# EAGLE schematic Alphabet_Boards (EAGLE 6.5.0)
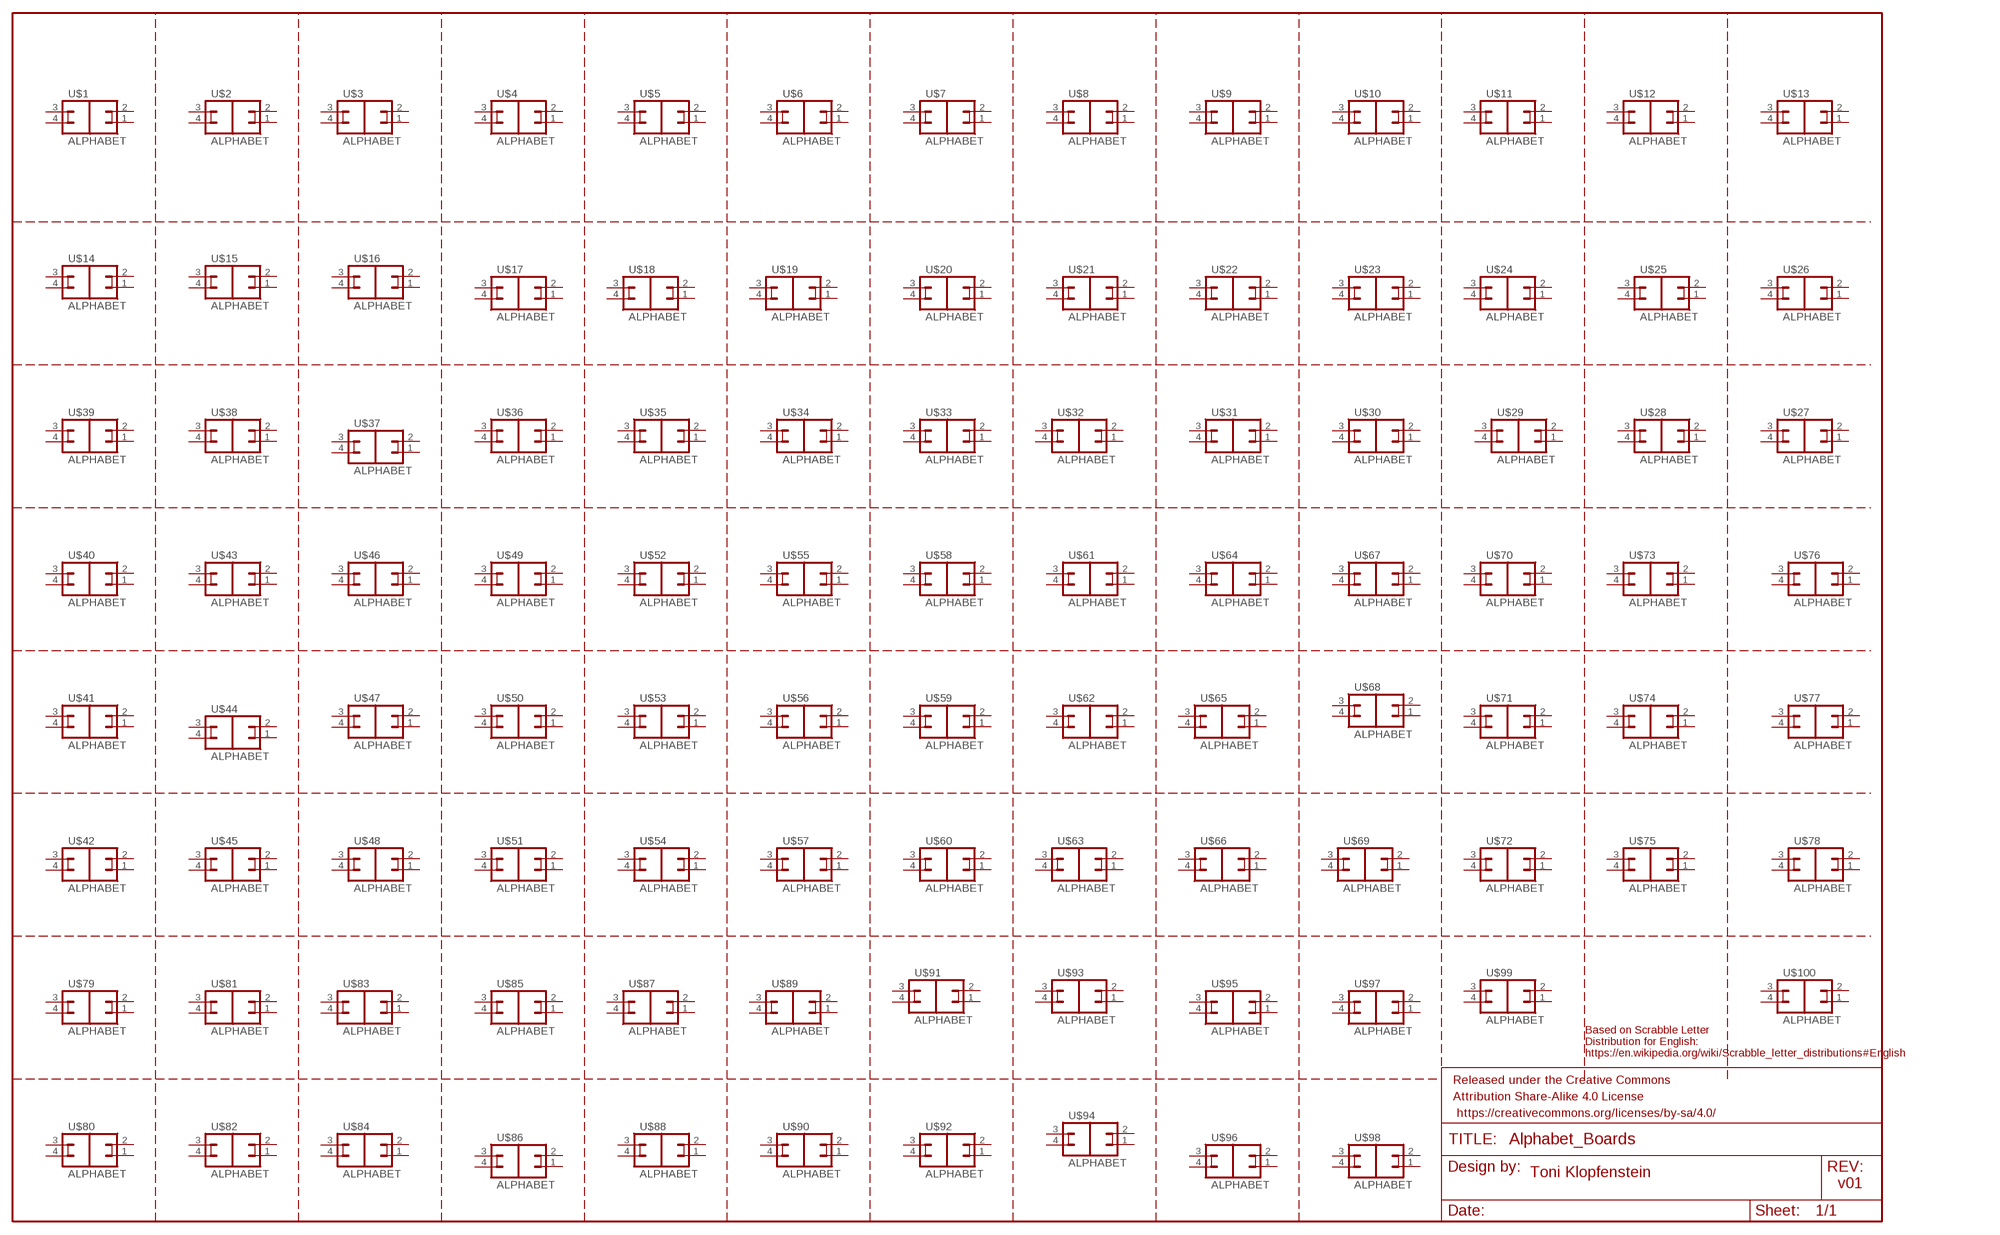
[diagram p0: schematic, sheet 1]

## Parts
FRAME1  FRAME-LEDGER  [CREATIVE_COMMONS]
U$1  ALPHABET  [ALPHABET_BOARD]
U$2  ALPHABET  [ALPHABET_BOARD]
U$3  ALPHABET  [ALPHABET_BOARD]
U$4  ALPHABET  [ALPHABET_BOARD]
U$5  ALPHABET  [ALPHABET_BOARD]
U$6  ALPHABET  [ALPHABET_BOARD]
U$7  ALPHABET  [ALPHABET_BOARD]
U$8  ALPHABET  [ALPHABET_BOARD]
U$9  ALPHABET  [ALPHABET_BOARD]
U$10  ALPHABET  [ALPHABET_BOARD]
U$11  ALPHABET  [ALPHABET_BOARD]
U$12  ALPHABET  [ALPHABET_BOARD]
U$13  ALPHABET  [ALPHABET_BOARD]
U$14  ALPHABET  [ALPHABET_BOARD]
U$15  ALPHABET  [ALPHABET_BOARD]
U$16  ALPHABET  [ALPHABET_BOARD]
U$17  ALPHABET  [ALPHABET_BOARD]
U$18  ALPHABET  [ALPHABET_BOARD]
U$19  ALPHABET  [ALPHABET_BOARD]
U$20  ALPHABET  [ALPHABET_BOARD]
U$21  ALPHABET  [ALPHABET_BOARD]
U$22  ALPHABET  [ALPHABET_BOARD]
U$23  ALPHABET  [ALPHABET_BOARD]
U$24  ALPHABET  [ALPHABET_BOARD]
U$25  ALPHABET  [ALPHABET_BOARD]
U$26  ALPHABET  [ALPHABET_BOARD]
U$27  ALPHABET  [ALPHABET_BOARD]
U$28  ALPHABET  [ALPHABET_BOARD]
U$29  ALPHABET  [ALPHABET_BOARD]
U$30  ALPHABET  [ALPHABET_BOARD]
U$31  ALPHABET  [ALPHABET_BOARD]
U$32  ALPHABET  [ALPHABET_BOARD]
U$33  ALPHABET  [ALPHABET_BOARD]
U$34  ALPHABET  [ALPHABET_BOARD]
U$35  ALPHABET  [ALPHABET_BOARD]
U$36  ALPHABET  [ALPHABET_BOARD]
U$37  ALPHABET  [ALPHABET_BOARD]
U$38  ALPHABET  [ALPHABET_BOARD]
U$39  ALPHABET  [ALPHABET_BOARD]
U$40  ALPHABET  [ALPHABET_BOARD]
U$41  ALPHABET  [ALPHABET_BOARD]
U$42  ALPHABET  [ALPHABET_BOARD]
U$43  ALPHABET  [ALPHABET_BOARD]
U$44  ALPHABET  [ALPHABET_BOARD]
U$45  ALPHABET  [ALPHABET_BOARD]
U$46  ALPHABET  [ALPHABET_BOARD]
U$47  ALPHABET  [ALPHABET_BOARD]
U$48  ALPHABET  [ALPHABET_BOARD]
U$49  ALPHABET  [ALPHABET_BOARD]
U$50  ALPHABET  [ALPHABET_BOARD]
U$51  ALPHABET  [ALPHABET_BOARD]
U$52  ALPHABET  [ALPHABET_BOARD]
U$53  ALPHABET  [ALPHABET_BOARD]
U$54  ALPHABET  [ALPHABET_BOARD]
U$55  ALPHABET  [ALPHABET_BOARD]
U$56  ALPHABET  [ALPHABET_BOARD]
U$57  ALPHABET  [ALPHABET_BOARD]
U$58  ALPHABET  [ALPHABET_BOARD]
U$59  ALPHABET  [ALPHABET_BOARD]
U$60  ALPHABET  [ALPHABET_BOARD]
U$61  ALPHABET  [ALPHABET_BOARD]
U$62  ALPHABET  [ALPHABET_BOARD]
U$63  ALPHABET  [ALPHABET_BOARD]
U$64  ALPHABET  [ALPHABET_BOARD]
U$65  ALPHABET  [ALPHABET_BOARD]
U$66  ALPHABET  [ALPHABET_BOARD]
U$67  ALPHABET  [ALPHABET_BOARD]
U$68  ALPHABET  [ALPHABET_BOARD]
U$69  ALPHABET  [ALPHABET_BOARD]
U$70  ALPHABET  [ALPHABET_BOARD]
U$71  ALPHABET  [ALPHABET_BOARD]
U$72  ALPHABET  [ALPHABET_BOARD]
U$73  ALPHABET  [ALPHABET_BOARD]
U$74  ALPHABET  [ALPHABET_BOARD]
U$75  ALPHABET  [ALPHABET_BOARD]
U$76  ALPHABET  [ALPHABET_BOARD]
U$77  ALPHABET  [ALPHABET_BOARD]
U$78  ALPHABET  [ALPHABET_BOARD]
U$79  ALPHABET  [ALPHABET_BOARD]
U$80  ALPHABET  [ALPHABET_BOARD]
U$81  ALPHABET  [ALPHABET_BOARD]
U$82  ALPHABET  [ALPHABET_BOARD]
U$83  ALPHABET  [ALPHABET_BOARD]
U$84  ALPHABET  [ALPHABET_BOARD]
U$85  ALPHABET  [ALPHABET_BOARD]
U$86  ALPHABET  [ALPHABET_BOARD]
U$87  ALPHABET  [ALPHABET_BOARD]
U$88  ALPHABET  [ALPHABET_BOARD]
U$89  ALPHABET  [ALPHABET_BOARD]
U$90  ALPHABET  [ALPHABET_BOARD]
U$91  ALPHABET  [ALPHABET_BOARD]
U$92  ALPHABET  [ALPHABET_BOARD]
U$93  ALPHABET  [ALPHABET_BOARD]
U$94  ALPHABET  [ALPHABET_BOARD]
U$95  ALPHABET  [ALPHABET_BOARD]
U$96  ALPHABET  [ALPHABET_BOARD]
U$97  ALPHABET  [ALPHABET_BOARD]
U$98  ALPHABET  [ALPHABET_BOARD]
U$99  ALPHABET  [ALPHABET_BOARD]
U$100  ALPHABET  [ALPHABET_BOARD]
Unconnected: U$1.1 U$1.2 U$1.3 U$1.4 U$2.1 U$2.2 U$2.3 U$2.4 U$3.1 U$3.2 U$3.3 U$3.4 U$4.1 U$4.2 U$4.3 U$4.4 U$5.1 U$5.2 U$5.3 U$5.4 U$6.1 U$6.2 U$6.3 U$6.4 U$7.1 U$7.2 U$7.3 U$7.4 U$8.1 U$8.2 U$8.3 U$8.4 U$9.1 U$9.2 U$9.3 U$9.4 U$10.1 U$10.2 U$10.3 U$10.4 U$11.1 U$11.2 U$11.3 U$11.4 U$12.1 U$12.2 U$12.3 U$12.4 U$13.1 U$13.2 U$13.3 U$13.4 U$14.1 U$14.2 U$14.3 U$14.4 U$15.1 U$15.2 U$15.3 U$15.4 U$16.1 U$16.2 U$16.3 U$16.4 U$17.1 U$17.2 U$17.3 U$17.4 U$18.1 U$18.2 U$18.3 U$18.4 U$19.1 U$19.2 U$19.3 U$19.4 U$20.1 U$20.2 U$20.3 U$20.4 U$21.1 U$21.2 U$21.3 U$21.4 U$22.1 U$22.2 U$22.3 U$22.4 U$23.1 U$23.2 U$23.3 U$23.4 U$24.1 U$24.2 U$24.3 U$24.4 U$25.1 U$25.2 U$25.3 U$25.4 U$26.1 U$26.2 U$26.3 U$26.4 U$27.1 U$27.2 U$27.3 U$27.4 U$28.1 U$28.2 U$28.3 U$28.4 U$29.1 U$29.2 U$29.3 U$29.4 U$30.1 U$30.2 U$30.3 U$30.4 U$31.1 U$31.2 U$31.3 U$31.4 U$32.1 U$32.2 U$32.3 U$32.4 U$33.1 U$33.2 U$33.3 U$33.4 U$34.1 U$34.2 U$34.3 U$34.4 U$35.1 U$35.2 U$35.3 U$35.4 U$36.1 U$36.2 U$36.3 U$36.4 U$37.1 U$37.2 U$37.3 U$37.4 U$38.1 U$38.2 U$38.3 U$38.4 U$39.1 U$39.2 U$39.3 U$39.4 U$40.1 U$40.2 U$40.3 U$40.4 U$41.1 U$41.2 U$41.3 U$41.4 U$42.1 U$42.2 U$42.3 U$42.4 U$43.1 U$43.2 U$43.3 U$43.4 U$44.1 U$44.2 U$44.3 U$44.4 U$45.1 U$45.2 U$45.3 U$45.4 U$46.1 U$46.2 U$46.3 U$46.4 U$47.1 U$47.2 U$47.3 U$47.4 U$48.1 U$48.2 U$48.3 U$48.4 U$49.1 U$49.2 U$49.3 U$49.4 U$50.1 U$50.2 U$50.3 U$50.4 U$51.1 U$51.2 U$51.3 U$51.4 U$52.1 U$52.2 U$52.3 U$52.4 U$53.1 U$53.2 U$53.3 U$53.4 U$54.1 U$54.2 U$54.3 U$54.4 U$55.1 U$55.2 U$55.3 U$55.4 U$56.1 U$56.2 U$56.3 U$56.4 U$57.1 U$57.2 U$57.3 U$57.4 U$58.1 U$58.2 U$58.3 U$58.4 U$59.1 U$59.2 U$59.3 U$59.4 U$60.1 U$60.2 U$60.3 U$60.4 U$61.1 U$61.2 U$61.3 U$61.4 U$62.1 U$62.2 U$62.3 U$62.4 U$63.1 U$63.2 U$63.3 U$63.4 U$64.1 U$64.2 U$64.3 U$64.4 U$65.1 U$65.2 U$65.3 U$65.4 U$66.1 U$66.2 U$66.3 U$66.4 U$67.1 U$67.2 U$67.3 U$67.4 U$68.1 U$68.2 U$68.3 U$68.4 U$69.1 U$69.2 U$69.3 U$69.4 U$70.1 U$70.2 U$70.3 U$70.4 U$71.1 U$71.2 U$71.3 U$71.4 U$72.1 U$72.2 U$72.3 U$72.4 U$73.1 U$73.2 U$73.3 U$73.4 U$74.1 U$74.2 U$74.3 U$74.4 U$75.1 U$75.2 U$75.3 U$75.4 U$76.1 U$76.2 U$76.3 U$76.4 U$77.1 U$77.2 U$77.3 U$77.4 U$78.1 U$78.2 U$78.3 U$78.4 U$79.1 U$79.2 U$79.3 U$79.4 U$80.1 U$80.2 U$80.3 U$80.4 U$81.1 U$81.2 U$81.3 U$81.4 U$82.1 U$82.2 U$82.3 U$82.4 U$83.1 U$83.2 U$83.3 U$83.4 U$84.1 U$84.2 U$84.3 U$84.4 U$85.1 U$85.2 U$85.3 U$85.4 U$86.1 U$86.2 U$86.3 U$86.4 U$87.1 U$87.2 U$87.3 U$87.4 U$88.1 U$88.2 U$88.3 U$88.4 U$89.1 U$89.2 U$89.3 U$89.4 U$90.1 U$90.2 U$90.3 U$90.4 U$91.1 U$91.2 U$91.3 U$91.4 U$92.1 U$92.2 U$92.3 U$92.4 U$93.1 U$93.2 U$93.3 U$93.4 U$94.1 U$94.2 U$94.3 U$94.4 U$95.1 U$95.2 U$95.3 U$95.4 U$96.1 U$96.2 U$96.3 U$96.4 U$97.1 U$97.2 U$97.3 U$97.4 U$98.1 U$98.2 U$98.3 U$98.4 U$99.1 U$99.2 U$99.3 U$99.4 U$100.1 U$100.2 U$100.3 U$100.4

## Notes on the sheet
- Based on Scrabble Letter
  Distribution for English:
  https://en.wikipedia.org/wiki/Scrabble_letter_distributions#English
- Toni Klopfenstein
- v01

## Library data of the parts
FRAME1 = SparkFun-Aesthetics:FRAME-LEDGER: Schematic Frame Standard 11x14 US Ledger frame
U$1-U$100 = Local Library:ALPHABET; PROD_ID: PCB-12193